# Altium schematic sheet FPGA1 PMOD Buffers.SchDoc
size A2; SheetNumber: 14; SheetTotal: 14
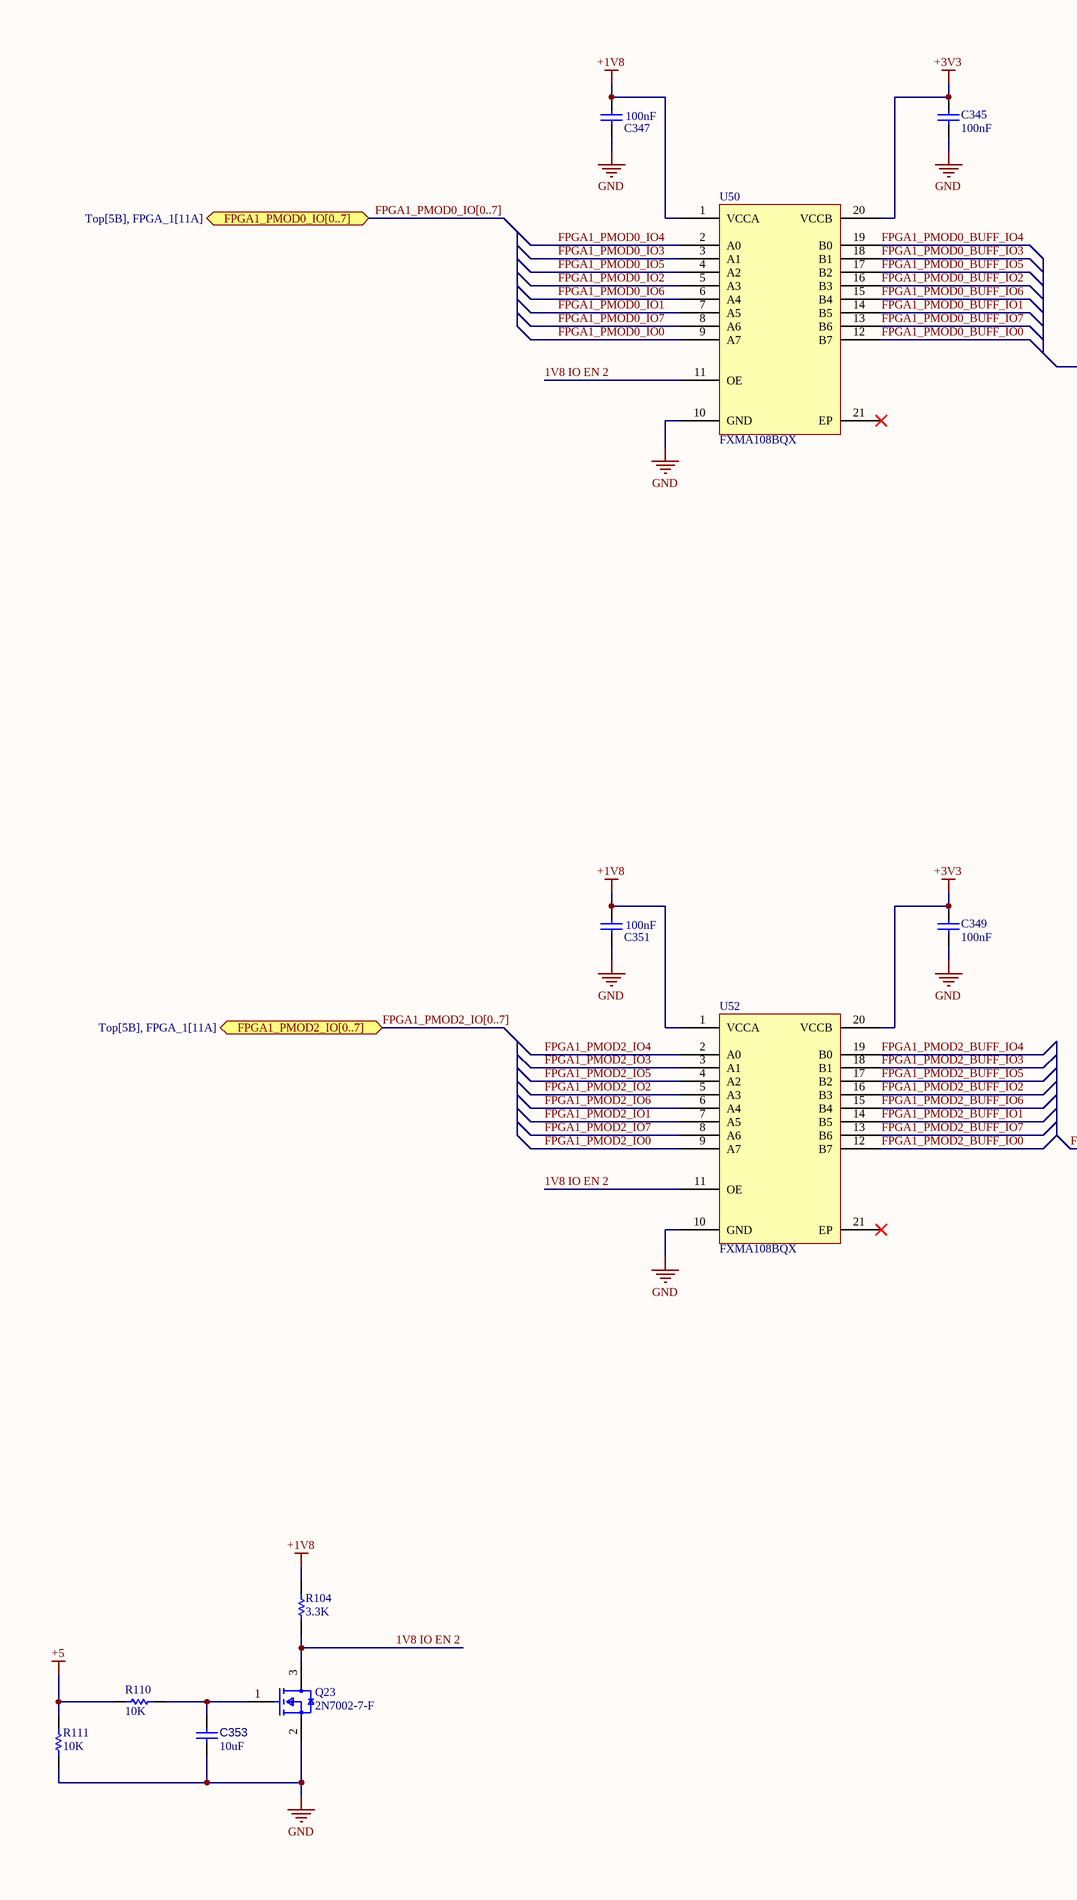
[diagram p0: FPGA1 PMOD Buffers.SchDoc, left]
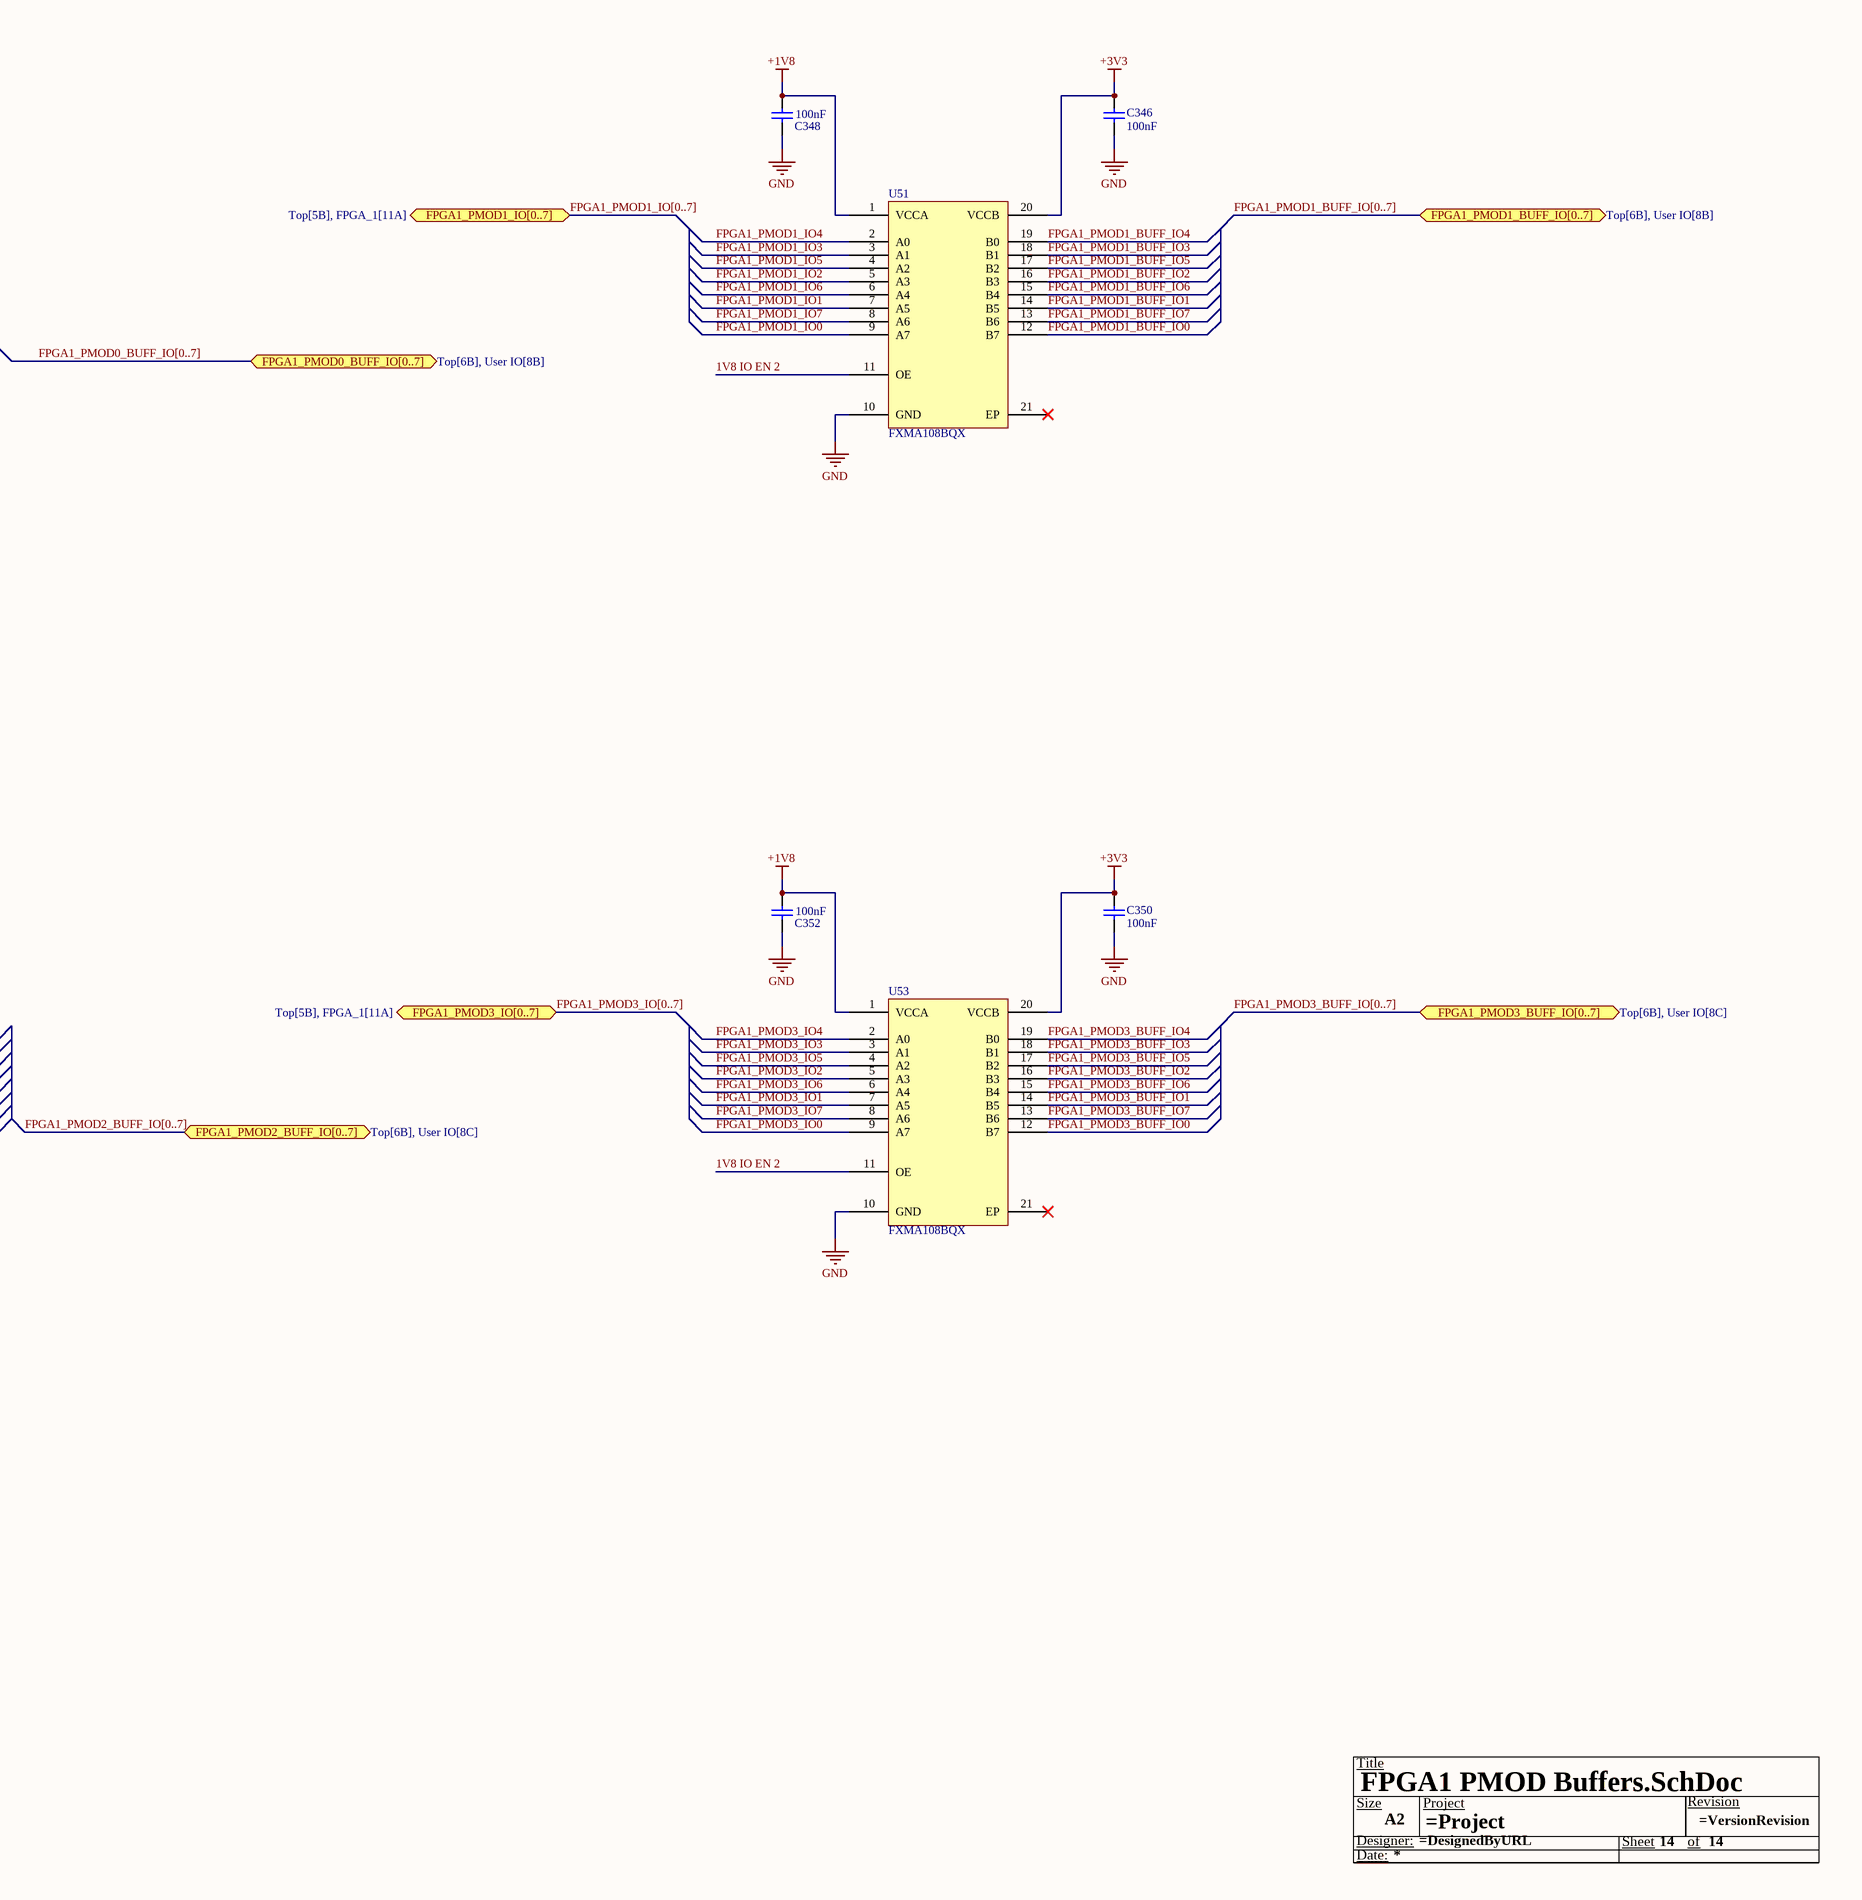
[diagram p1: FPGA1 PMOD Buffers.SchDoc, right]

## Parts
*  Size: A2  (hidden comment: Title Block)  (graphical)
C345  100nF  [CAPC1005X05N]
C346  100nF  [CAPC1005X05N]
C347  100nF  [CAPC1005X05N]
C348  100nF  [CAPC1005X05N]
C349  100nF  [CAPC1005X05N]
C350  100nF  [CAPC1005X05N]
C351  100nF  [CAPC1005X05N]
C352  100nF  [CAPC1005X05N]
C353  value 10uF  [CAPC1608X04N]  (hidden comment: GRM188R61E106MA73D)
Q23  2N7002-7-F  [FP-SOT23-MFG]
R104  3.3K  [RESC1005X40X25NL05T10]
R110  10K  [RESC1005X40X25NL05T10]
R111  10K  [RESC1005X40X25NL05T10]
U50  FXMA108BQX  [QFN50P450X250X80_HS-21N]
U51  FXMA108BQX  [QFN50P450X250X80_HS-21N]
U52  FXMA108BQX  [QFN50P450X250X80_HS-21N]
U53  FXMA108BQX  [QFN50P450X250X80_HS-21N]

## Ports
FPGA1_PMOD0_BUFF_IO[0..7] (bidir, see Top[6B], User IO[8B]), FPGA1_PMOD0_IO[0..7] (bidir, see Top[5B], FPGA_1[11A]), FPGA1_PMOD1_BUFF_IO[0..7] (bidir, see Top[6B], User IO[8B]), FPGA1_PMOD1_IO[0..7] (bidir, see Top[5B], FPGA_1[11A]), FPGA1_PMOD2_BUFF_IO[0..7] (bidir, see Top[6B], User IO[8C]), FPGA1_PMOD2_IO[0..7] (bidir, see Top[5B], FPGA_1[11A]), FPGA1_PMOD3_BUFF_IO[0..7] (bidir, see Top[6B], User IO[8C]), FPGA1_PMOD3_IO[0..7] (bidir, see Top[5B], FPGA_1[11A])

## Nets
+1V8: C347.2 C348.2 C351.2 C352.2 R104.2 U50.1(VCCA) U51.1(VCCA) U52.1(VCCA) U53.1(VCCA)
+3V3: C345.2 C346.2 C349.2 C350.2 U50.20(VCCB) U51.20(VCCB) U52.20(VCCB) U53.20(VCCB)
+5: R110.2 R111.1
GND: C345.1 C346.1 C347.1 C348.1 C349.1 C350.1 C351.1 C352.1 C353.1 Q23.2(S) R111.2 U50.10(GND) U51.10(GND) U52.10(GND) U53.10(GND)
1V8 IO EN 2: Q23.3(D) R104.1 U50.11(OE) U51.11(OE) U52.11(OE) U53.11(OE)
FPGA1_PMOD0_BUFF_IO0: U50.12(B7)
FPGA1_PMOD0_BUFF_IO1: U50.14(B5)
FPGA1_PMOD0_BUFF_IO2: U50.16(B3)
FPGA1_PMOD0_BUFF_IO3: U50.18(B1)
FPGA1_PMOD0_BUFF_IO4: U50.19(B0)
FPGA1_PMOD0_BUFF_IO5: U50.17(B2)
FPGA1_PMOD0_BUFF_IO6: U50.15(B4)
FPGA1_PMOD0_BUFF_IO7: U50.13(B6)
FPGA1_PMOD0_IO0: U50.9(A7)
FPGA1_PMOD0_IO1: U50.7(A5)
FPGA1_PMOD0_IO2: U50.5(A3)
FPGA1_PMOD0_IO3: U50.3(A1)
FPGA1_PMOD0_IO4: U50.2(A0)
FPGA1_PMOD0_IO5: U50.4(A2)
FPGA1_PMOD0_IO6: U50.6(A4)
FPGA1_PMOD0_IO7: U50.8(A6)
FPGA1_PMOD1_BUFF_IO0: U51.12(B7)
FPGA1_PMOD1_BUFF_IO1: U51.14(B5)
FPGA1_PMOD1_BUFF_IO2: U51.16(B3)
FPGA1_PMOD1_BUFF_IO3: U51.18(B1)
FPGA1_PMOD1_BUFF_IO4: U51.19(B0)
FPGA1_PMOD1_BUFF_IO5: U51.17(B2)
FPGA1_PMOD1_BUFF_IO6: U51.15(B4)
FPGA1_PMOD1_BUFF_IO7: U51.13(B6)
FPGA1_PMOD1_IO0: U51.9(A7)
FPGA1_PMOD1_IO1: U51.7(A5)
FPGA1_PMOD1_IO2: U51.5(A3)
FPGA1_PMOD1_IO3: U51.3(A1)
FPGA1_PMOD1_IO4: U51.2(A0)
FPGA1_PMOD1_IO5: U51.4(A2)
FPGA1_PMOD1_IO6: U51.6(A4)
FPGA1_PMOD1_IO7: U51.8(A6)
FPGA1_PMOD2_BUFF_IO0: U52.12(B7)
FPGA1_PMOD2_BUFF_IO1: U52.14(B5)
FPGA1_PMOD2_BUFF_IO2: U52.16(B3)
FPGA1_PMOD2_BUFF_IO3: U52.18(B1)
FPGA1_PMOD2_BUFF_IO4: U52.19(B0)
FPGA1_PMOD2_BUFF_IO5: U52.17(B2)
FPGA1_PMOD2_BUFF_IO6: U52.15(B4)
FPGA1_PMOD2_BUFF_IO7: U52.13(B6)
FPGA1_PMOD2_IO0: U52.9(A7)
FPGA1_PMOD2_IO1: U52.7(A5)
FPGA1_PMOD2_IO2: U52.5(A3)
FPGA1_PMOD2_IO3: U52.3(A1)
FPGA1_PMOD2_IO4: U52.2(A0)
FPGA1_PMOD2_IO5: U52.4(A2)
FPGA1_PMOD2_IO6: U52.6(A4)
FPGA1_PMOD2_IO7: U52.8(A6)
FPGA1_PMOD3_BUFF_IO0: U53.12(B7)
FPGA1_PMOD3_BUFF_IO1: U53.14(B5)
FPGA1_PMOD3_BUFF_IO2: U53.16(B3)
FPGA1_PMOD3_BUFF_IO3: U53.18(B1)
FPGA1_PMOD3_BUFF_IO4: U53.19(B0)
FPGA1_PMOD3_BUFF_IO5: U53.17(B2)
FPGA1_PMOD3_BUFF_IO6: U53.15(B4)
FPGA1_PMOD3_BUFF_IO7: U53.13(B6)
FPGA1_PMOD3_IO0: U53.9(A7)
FPGA1_PMOD3_IO1: U53.7(A5)
FPGA1_PMOD3_IO2: U53.5(A3)
FPGA1_PMOD3_IO3: U53.3(A1)
FPGA1_PMOD3_IO4: U53.2(A0)
FPGA1_PMOD3_IO5: U53.4(A2)
FPGA1_PMOD3_IO6: U53.6(A4)
FPGA1_PMOD3_IO7: U53.8(A6)
NetC353_2: C353.2 Q23.1(G) R110.1

Not connected (* = marked no-connect by the designer): U50 21(EP)*; U51 21(EP)*; U52 21(EP)*; U53 21(EP)*

## Buses and harness runs
bus FPGA1_PMOD0_BUFF_IO[0..7] = port FPGA1_PMOD0_BUFF_IO[0..7]
bus FPGA1_PMOD0_IO[0..7] = port FPGA1_PMOD0_IO[0..7]
bus FPGA1_PMOD1_BUFF_IO[0..7] = port FPGA1_PMOD1_BUFF_IO[0..7]
bus FPGA1_PMOD1_IO[0..7] = port FPGA1_PMOD1_IO[0..7]
bus FPGA1_PMOD2_BUFF_IO[0..7] = port FPGA1_PMOD2_BUFF_IO[0..7]
bus FPGA1_PMOD2_IO[0..7] = port FPGA1_PMOD2_IO[0..7]
bus FPGA1_PMOD3_BUFF_IO[0..7] = port FPGA1_PMOD3_BUFF_IO[0..7]
bus FPGA1_PMOD3_IO[0..7] = port FPGA1_PMOD3_IO[0..7]

## Notes on the sheet
- (in symbol CMP-007-000006-8) Title; Size; Project; Revision; Designer:; Sheet; of; Date:

## Library data of the parts
* = CMP-007-000006-8: Generic Title Block
C345-C352 = CMP-001-00095-1: Cap Ceramic 0.1uF 50V X7R 20% SMD 0402 125°C Paper T/R GRM155R71H104ME14J; Voltage: 50V; Capacitance: 100nF; Case: 0402
C353 = CMP-001-00096-1: CAP CER 10UF 25V X5R 0603; Tolerance: 20%; Dielectric: X5R; Case/Package: 0603; Voltage: 25V
Q23 = CMP-2000-04929-2: MOSFET N-CH 60V 115MA SOT23-3; Turn-On Delay Time: 7ns; Turn-Off Delay Time: 11ns; Drain to Source Resistance: 7.5R; Rise Time: 3ns; Drain to Source Breakdown Voltage: 70V; Input Capacitance: 50pF; Number of Elements: 1; Power Dissipation: 540mW; Max Power Dissipation: 300mW; Fall Time: 5.6ns; Gate to Source Voltage (Vgs): 20V; Threshold Voltage: 2.5V; Element Configuration: Single; Termination: SMD/SMT; Weight: 0.000282oz; Radiation Hardening: No; Max Operating Temperature: 150°C; On-State Resistance: 7.5R; Mount: Surface Mount; Current Rating: 115mA; Contact Plating: Tin; Lead Free: Lead Free; Min Operating Temperature: -55°C; Number of Pins: 3; REACH SVHC: No SVHC; Drain to Source Voltage (Vdss): 60V; Width: 1.3mm; Package Quantity: 3000; Length: 2.9mm; Case/Package: SOT-23; Number of Channels: 1; Dual Supply Voltage: 60V; Packaging: Tape and Reel; Height: 1mm; Voltage Rating (DC): 60V; Nominal Vgs: 2.5V; Continuous Drain Current (ID): 115mA; Voltage: 60V; Rds On Max: 7.5R
R104 = CMP-2002-03055-1: CRCW04023K30FKEDHP; Manufacturer: Vishay Dale; Part Number: CRCW04023K30FKEDHP
R110 R111 = CMP-2002-07353-1: RC0402FR-0710KL; Manufacturer: Yageo / Phycomp; Part Number: RC0402FR-0710KL
U50-U53 = CMP-015-00018-1: FXMA108 Series 3.6 V Surface Mount Dual Supply 8-Bit Voltage Translator -DQFN-20; Min Supply Voltage: 1.65V; Propagation Delay: 1700ns; Number of Circuits: 1; Number of Channels: 8; Max Supply Voltage: 5.5V; Data Rate: 100Mbps; Logic Function: Translator; Case/Package: QFN